# EasyEDA Pro project EDA-Robot_V1.2.epro

# Schematic EDA-Robot插件版
Board Name: Board2; Create Date: 2024-12-02; Page Name: P1; Project Name: EDA-Robot; Schematic Name: EDA-Robot插件版; Update Date: 2024-12-19; Company: 嘉立创EDA; Page Size: A4; Version: V1.0
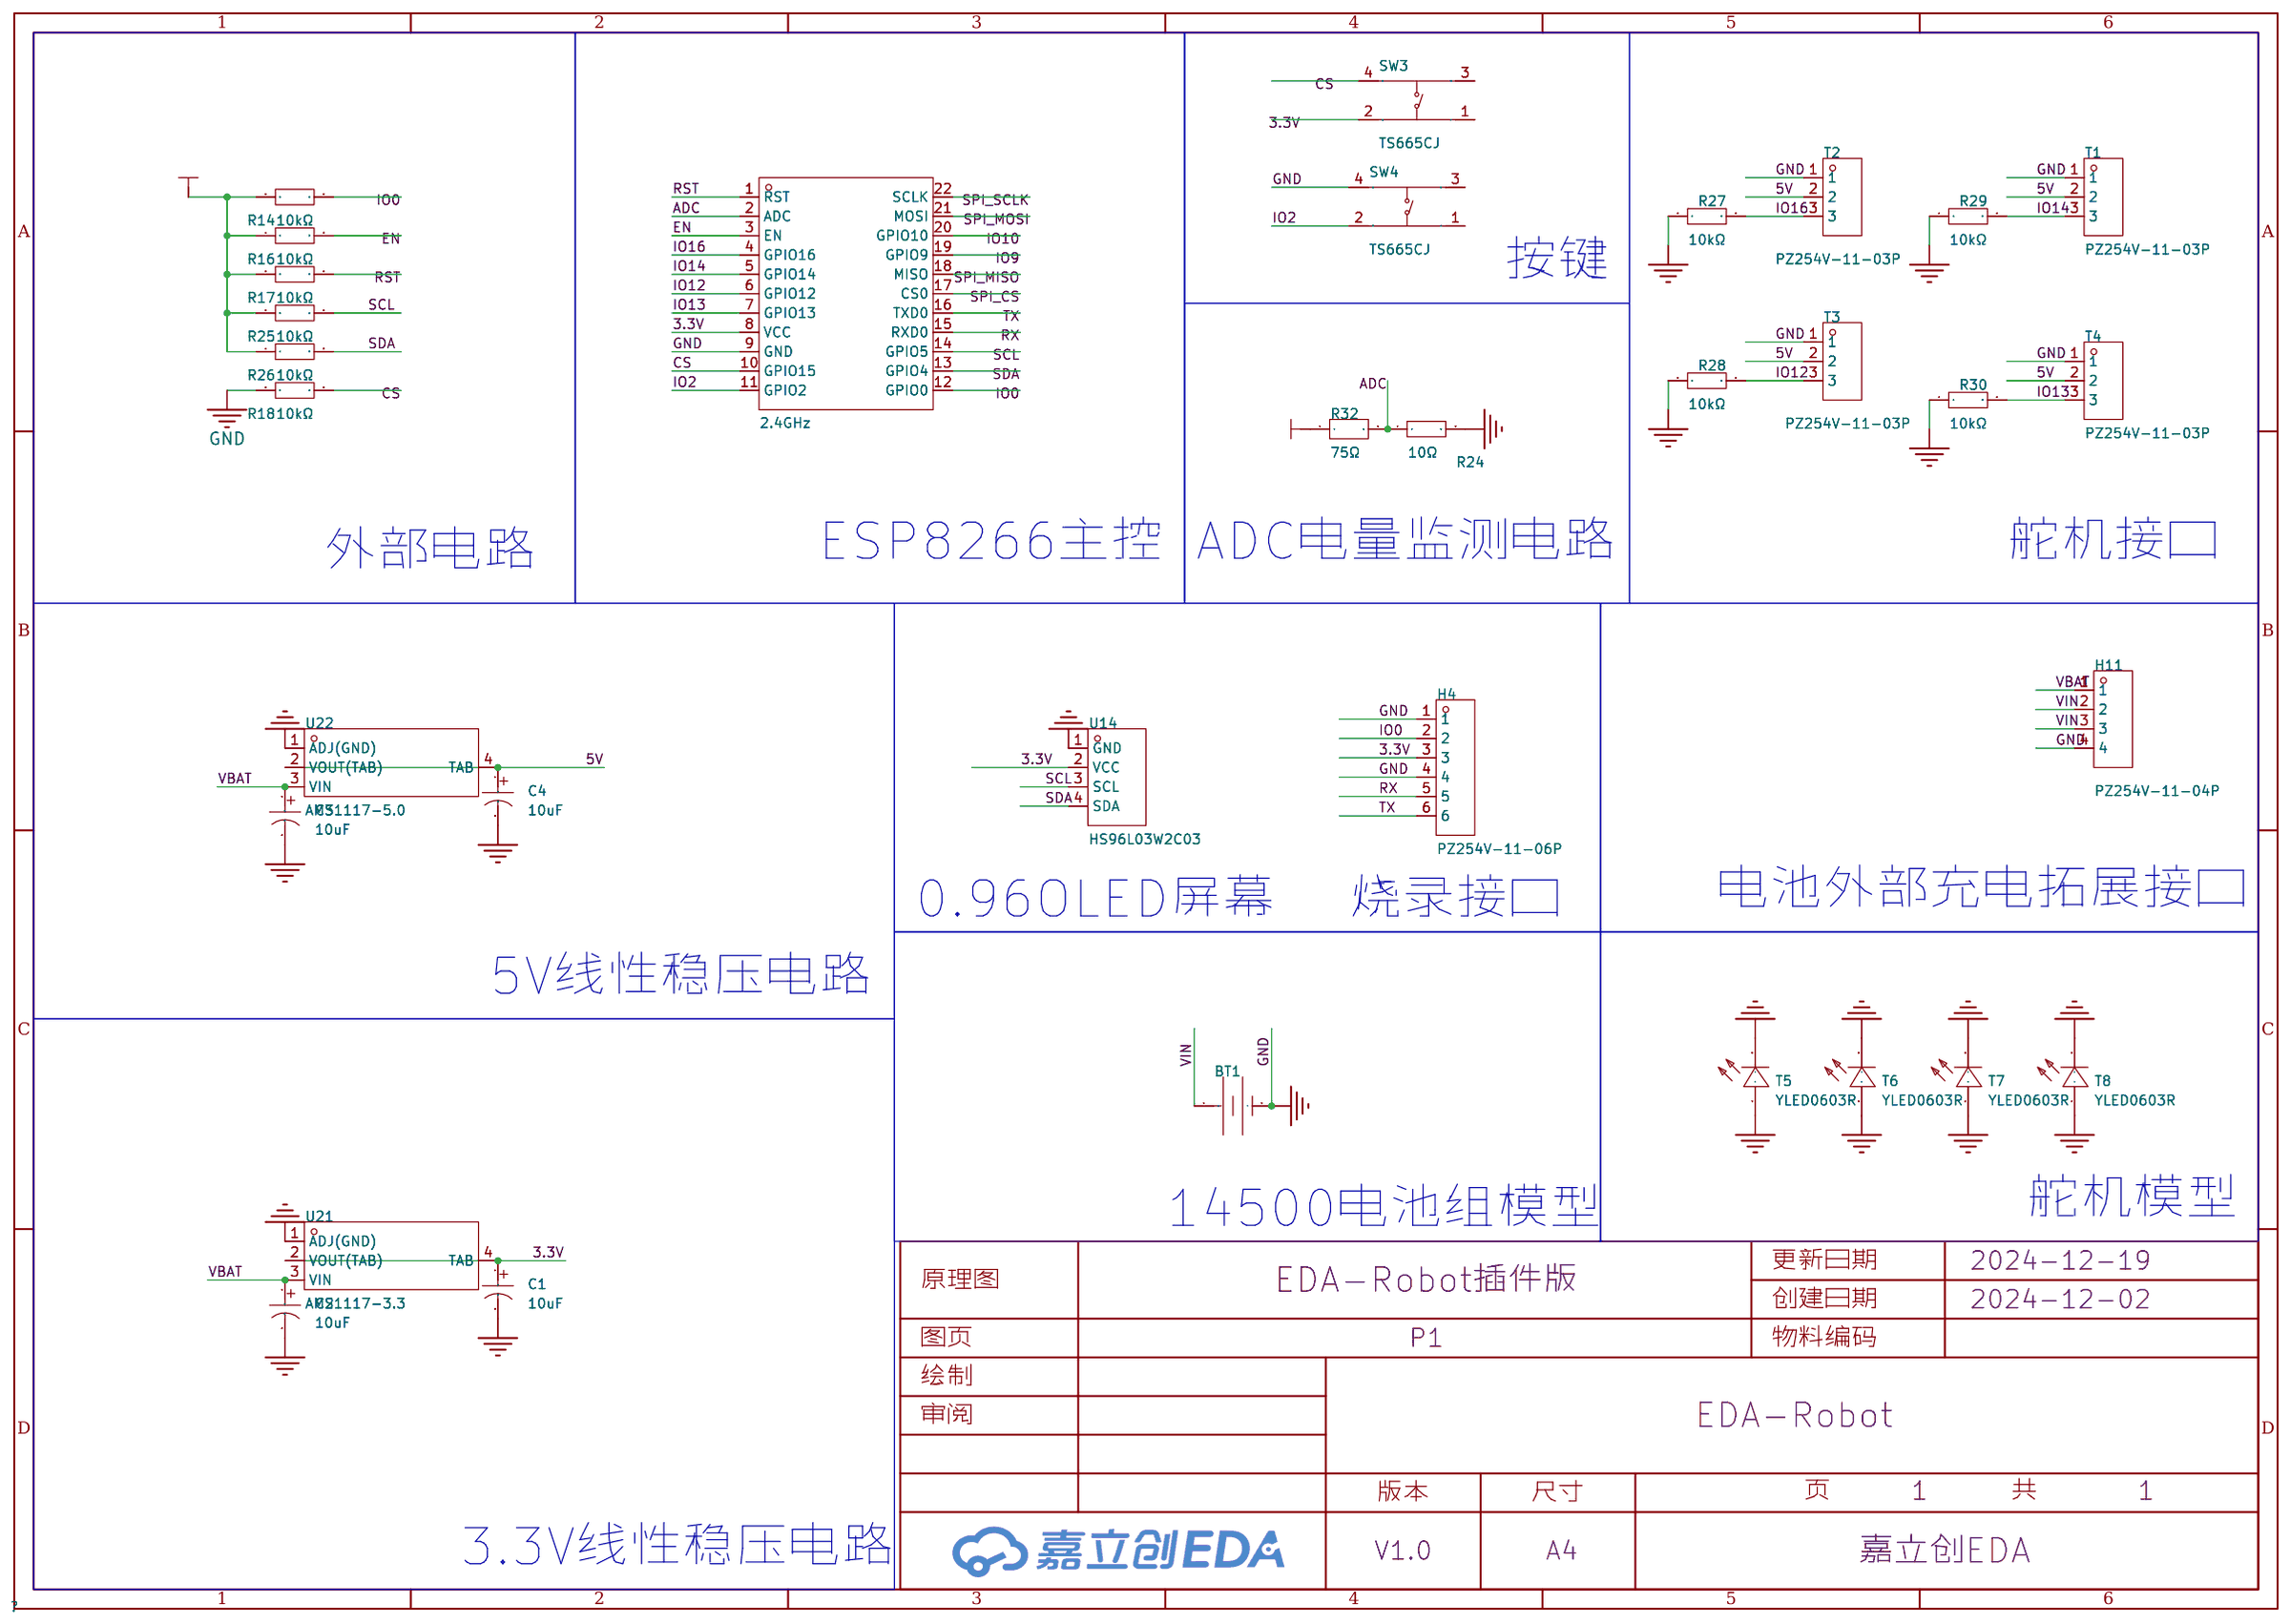
[diagram p0: schematic sheet]

## Parts
BT1  BS-12-B3AA003  [14500电池盒*2]
C1  10uF  [CAP-TH_BD4.0-P1.50-D0.8-FD]
C2  10uF  [CAP-TH_BD4.0-P1.50-D0.8-FD]
C3  10uF  [CAP-TH_BD4.0-P1.50-D0.8-FD]
C4  10uF  [CAP-TH_BD4.0-P1.50-D0.8-FD]
H4  PZ254V-11-06P  [HDR-TH_6P-P2.54-V-M]
H11  PZ254V-11-04P  [HDR-TH_4P-P2.54-V-M]
R14  10kΩ  [RES-TH_BD2.4-L6.3-P10.30-D0.6]
R16  10kΩ  [RES-TH_BD2.4-L6.3-P10.30-D0.6]
R17  10kΩ  [RES-TH_BD2.4-L6.3-P10.30-D0.6]
R18  10kΩ  [RES-TH_BD2.4-L6.3-P10.30-D0.6]
R24  10Ω  [RES-TH_BD2.2-L6.5-P10.50-D0.6]
R25  10kΩ  [RES-TH_BD2.4-L6.3-P10.30-D0.6]
R26  10kΩ  [RES-TH_BD2.4-L6.3-P10.30-D0.6]
R27  10kΩ  [RES-TH_BD2.4-L6.3-P10.30-D0.6]
R28  10kΩ  [RES-TH_BD2.4-L6.3-P10.30-D0.6]
R29  10kΩ  [RES-TH_BD2.4-L6.3-P10.30-D0.6]
R30  10kΩ  [RES-TH_BD2.4-L6.3-P10.30-D0.6]
R32  75Ω  [RES-TH_BD2.4-L6.3-P10.30-D0.6]
SW3  TS665CJ  [SW-TH_4P-L6.0-W6.0-P4.50-LS6.5]
SW4  TS665CJ  [SW-TH_4P-L6.0-W6.0-P4.50-LS6.5]
T1  PZ254V-11-03P  [HDR-TH_3P-P2.54-V-M]
T2  PZ254V-11-03P  [HDR-TH_3P-P2.54-V-M]
T3  PZ254V-11-03P  [HDR-TH_3P-P2.54-V-M]
T4  PZ254V-11-03P  [HDR-TH_3P-P2.54-V-M]
T5  YLED0603R  [LED0603-FD]  (no BOM)
T6  YLED0603R  [LED0603-FD]  (no BOM)
T7  YLED0603R  [LED0603-FD]  (no BOM)
T8  YLED0603R  [LED0603-FD]  (no BOM)
U10  2.4GHz  [WIFIM-SMD_ESP-12F-ESP8266MOD]
U14  HS96L03W2C03  [OLED-TH_L27.8-W27.2-P2.54_C9900033791]
U21  AMS1117-3.3  [SOT-223-4_L6.5-W3.5-P2.30-LS7.0-BR]
U22  AMS1117-5.0  [SOT-223_L6.7-W3.5-P2.30-BR]

## Library data of the parts
BT1 = BS-12-B3AA003: 连接器类型:电池底座;适用电池规格:CR1220;触头材质:磷青铜;工作温度范围:-25℃~+85℃;; LCSC Part Name: 电池底座 适用电池:CR1220; Supplier Part: C964723; Manufacturer: MYOUNG(美阳); Supplier Footprint: SMD; JLCPCB Part Class: 扩展库; Datasheet: https://atta.szlcsc.com/upload/public/pdf/source/20201218/C964723_733B638E287393F86295A2A4DAE43C75.pdf; Supplier: LCSC; Connector Type: 电池底座; Battery Type: CR1220; Contact Material: 磷青铜; Operating Temperature Range: -25℃~+85℃
C1-C4 = KS106M025C07RR0VH2FP0: 容值:10uF;精度:±20%;额定电压:25V;纹波电流:29mA@120Hz;等效串联电阻:-;; LCSC Part Name: 10uF ±20% 25V; Supplier Part: C43351; Manufacturer: CX(承兴); Supplier Footprint: 插件,D4xL7mm; JLCPCB Part Class: 扩展库; Datasheet: https://atta.szlcsc.com/upload/public/pdf/source/20211027/7B10195EF01EB9374BE8935690E3D906.pdf; Supplier: LCSC; Tolerance: ±20%; Rated Voltage: 25V; Ripple Current: 29mA@120Hz; Lead Spacing: 1.5mm; φD: 4mm; L: 7mm; Lifetime @ Temp: 1000hrs@105℃; Operating Temperature: -40℃~+105℃
H4 = PZ254V-11-06P: 插针结构:1x6P;间距:2.54mm;行距:-;圆针/方针:方针;安装类型:直插;排数:单排;总PIN位数:6P;额定电流:-;额定电压:-;配合针长度:6mm;塑高:2.5mm;端接针长度:3mm;触头材质:黄铜;触头镀层:-;工作温度范围:-40℃~+105℃;颜色:黑色;; LCSC Part Name: 间距:2.54mm 1x6P 直插 方针; Supplier Part: C492405; Manufacturer: XFCN(兴飞); Supplier Footprint: 插件,P=2.54mm; JLCPCB Part Class: 扩展库; Datasheet: https://atta.szlcsc.com/upload/public/pdf/source/20200309/C492405_597F1930F5B55CC3C7FD95458F1C3977.pdf; Supplier: LCSC; Pin Structure: 1x6P; Pitch: 2.54mm; Circluar Pins/Square Pins: 方针; Mounting Type: 直插; Number of Rows: 单排; Number of Pins: 6P; Length of Mating Pin: 6mm; Insulation Height: 2.5mm; Length of End Connection Pin: 3mm; Contact Material: 黄铜; Operating Temperature Range: -40℃~+105℃; Color: 黑色
H11 = PZ254V-11-04P: 插针结构:1x4P;间距:2.54mm;行距:-;圆针/方针:方针;安装类型:直插;排数:单排;总PIN位数:4P;额定电流:3A;额定电压:250V;配合针长度:6mm;塑高:2.5mm;端接针长度:3mm;触头材质:-;工作温度范围:-40℃~+105℃;颜色:黑色;; LCSC Part Name: 间距:2.54mm 1x4P 直插 方针; Supplier Part: C2691448; Manufacturer: XFCN(兴飞); Supplier Footprint: 插件,P=2.54mm; JLCPCB Part Class: 扩展库; Datasheet: https://atta.szlcsc.com/upload/public/pdf/source/20200309/C492403_F9F19131791D08044AD4F84F8E751A34.pdf; Supplier: LCSC; Pin Structure: 1x4P; Pitch: 2.54mm; Circluar Pins/Square Pins: 方针; Mounting Type: 直插; Number of Rows: 单排; Number of Pins: 4P; Current Rating (Max): 3A; Voltage Rating (Max): 250V; Length of Mating Pin: 6mm; Insulation Height: 2.5mm; Length of End Connection Pin: 3mm; Operating Temperature Range: -40℃~+105℃; Color: 黑色
R14 R16-R18 R25-R30 = RN1/4W10KFT/BA1: 电阻类型:金属膜电阻;阻值:10kΩ;精度:±1%;功率:250mW;温度系数:±50ppm/℃;; LCSC Part Name: 10kΩ ±1% 250mW 金属膜电阻; Supplier Part: C410695; Manufacturer: Tyohm(幸亚电阻); Supplier Footprint: 插件,D2.4xL6.5mm; JLCPCB Part Class: Extended Part; Datasheet: https://atta.szlcsc.com/upload/public/pdf/source/20190808/C410699_D126E64D28B638F1D73B58E9F61DFD9B.pdf; Supplier: LCSC; Type: 金属膜电阻; Tolerance: ±1%; Overload Voltage (Max): 250V; Power(Watts): 250mW; Temperature Coefficient: ±50ppm/℃; Operating Temperature Range: -55℃~+125℃
R24 = MFR-25FTE52-10R: 电阻类型:金属膜电阻;阻值:10Ω;精度:±1%;功率:250mW;温度系数:±50ppm/℃;; LCSC Part Name: 金属膜电阻 10Ω ±1% 250mW; Supplier Part: C138214; Manufacturer: YAGEO(国巨); Supplier Footprint: 插件,D2.4xL6.3mm; JLCPCB Part Class: Extended Part; Datasheet: https://atta.szlcsc.com/upload/public/pdf/source/20191118/C457825_18355E864DE4965678DC27B0EBC3E21E.pdf; Supplier: LCSC; Type: 金属膜电阻; Tolerance: ±1%; Power(Watts): 250mW; Temperature Coefficient: ±50ppm/℃; Operating Temperature Range: -55℃~+155℃
R32 = MFR-25FTE52-75R: 电阻类型:金属膜电阻;阻值:75Ω;精度:±1%;功率:250mW;温度系数:±50ppm/℃;; LCSC Part Name: 金属膜电阻 75Ω ±1% 250mW; Supplier Part: C513654; Manufacturer: YAGEO(国巨); Supplier Footprint: 插件,D2.4xL6.3mm; JLCPCB Part Class: 扩展库; Datasheet: https://atta.szlcsc.com/upload/public/pdf/source/20191118/C457825_18355E864DE4965678DC27B0EBC3E21E.pdf; Supplier: LCSC; Type: 金属膜电阻; Tolerance: ±1%; Power(Watts): 250mW; Temperature Coefficient: ±50ppm/℃; Operating Temperature Range: -55℃~+155℃
SW3 SW4 = TS665CJ: 电路结构:单刀单掷;按钮形状:圆形按钮;安装方式:直插;开关长度:6mm;开关宽度:6mm;开关高度:5mm;触点电流:50mA;额定电压(DC):12V;带灯:-;机械寿命:-;; LCSC Part Name: 6*6*5mm 直插 轻触开关; Supplier Part: C393938; Manufacturer: SHOU HAN(首韩); Supplier Footprint: 插件; JLCPCB Part Class: 扩展库; Datasheet: https://atta.szlcsc.com/upload/public/pdf/source/20190521/C393938_BDABEAC600B4C55E200A80AA129B70BC.pdf; Supplier: LCSC; Circuit: 单刀单掷; Actuator Style: 圆形按钮; Mounting Style: 直插; Switch Length: 6mm; Switch Width: 6mm; Switch Height: 5mm; Contact Current: 50mA; Voltage Rating (DC): 12V
T1-T4 = PZ254V-11-03P: 插针结构:1x3P;间距:2.54mm;行距:-;圆针/方针:方针;安装类型:直插;排数:单排;总PIN位数:3P;额定电流:3A;额定电压:250V;配合针长度:6mm;塑高:2.5mm;端接针长度:3mm;工作温度范围:-40℃~+105℃;颜色:黑色;; LCSC Part Name: 间距:2.54mm 1x3P 直插 方针; Supplier Part: C2937625; Manufacturer: XFCN(兴飞); Supplier Footprint: 插件,P=2.54mm; JLCPCB Part Class: 扩展库; Datasheet: https://atta.szlcsc.com/upload/public/pdf/source/20200309/C492402_8335C3D49C4E4C618838D59BB1D024C1.pdf; Supplier: LCSC; Pin Structure: 1x3P; Pitch: 2.54mm; Circluar Pins/Square Pins: 方针; Mounting Type: 直插; Number of Rows: 单排; Number of Pins: 3P; Current Rating (Max): 3A; Voltage Rating (Max): 250V; Length of Mating Pin: 6mm; Insulation Height: 2.5mm; Length of End Connection Pin: 3mm; Operating Temperature Range: -40℃~+105℃; Color: 黑色
T5-T8 = YLED0603R: 发光颜色:红色;正向电压(VF):1.8V~2.4V;功率:-;正向电流:25mA;主波长:620nm~625nm;二极管配置:-;透镜颜色:-;色温:-;发光强度:-;发光角度:-;载带方式:-;工作温度:-40℃~+85℃;; Supplier Part: C19171390; Manufacturer: YONGYUTAI(永裕泰); Supplier Footprint: 0603; JLCPCB Part Class: 扩展库; Datasheet: https://atta.szlcsc.com/upload/public/pdf/source/20231027/FB19AF06E2C70028E58AB5CEDD1BDC72.pdf; Supplier: LCSC; Emitted Color: 红色; Forward Voltage (VF): 1.8V~2.4V; Forward Current: 25mA; Dominant Wavelength: 620nm~625nm; Operating Temperature: -40℃~+85℃
U10 = ESP-12F(ESP8266MOD): 频率:2.4GHz;发射功率:16dBm;核心处理器:ESP8266;天线形式:PCB 板载天线;接收灵敏度:-90dBm;; LCSC Part Name: 完整的802.11b/g/n Wi-Fi的SoC模块; Supplier Part: C82891; Manufacturer: Ai-Thinker(安信可); Supplier Footprint: SMD,16x24mm; JLCPCB Part Class: Extended Part; Datasheet: https://atta.szlcsc.com/upload/public/pdf/source/20210219/C82891_ABD84A460F4F056A2757267CCCA4B508.pdf; Supplier: LCSC; Output Power: 16dBm; Core Processor: ESP8266; Support Interface: GPIO；UART；I2C；PWM；SPI；ADC; Antenna Type: PCB 板载天线; Wireless Standard: 802.11b/g/n; Operating Voltage: 3.3V; Receive  Current: 120mA; Send  Current: 170mA; Sensitivity: -90dBm; Operating Temperature: -40℃~+85℃
U14 = HS96L03W2C03: 主控芯片:SSD1315;接口类型:I2C;尺寸(inch):0.96;像素分辨率:128x64;; LCSC Part Name: 0.96寸OLED显示屏窄白光IIC; Supplier Part: C5248080; Manufacturer: HS(汉昇); JLCPCB Part Class: 扩展库; Datasheet: https://atta.szlcsc.com/upload/public/pdf/source/20230627/763D01F79A90007632F098068C7C8AD9.pdf; Supplier: LCSC; Main Control Chip: SSD1315; Interface Type: I2C; Size: 0.96; Pixel Resolution: 128x64; Operating Temperature: -40℃~+70℃
U21 = AMS1117-3.3_C347222: 输出类型:固定;最大输入电压:18V;输出电压:3.3V;输出电流:1A;电源纹波抑制比(PSRR):60dB@(120Hz);输出极性:正极;; LCSC Part Name: 输出:3.3V 电流:1A 耐压:12V; Supplier Part: C347222; Manufacturer: UMW(友台半导体); Supplier Footprint: SOT-223; JLCPCB Part Class: 扩展库; Datasheet: https://atta.szlcsc.com/upload/public/pdf/source/20231109/155D79A26D9DB04352555A58D5969DC8.pdf; Supplier: LCSC; Output Type: 固定; Maximum Input Voltage: 18V; Output Voltage: 3.3V; Output Current: 1A; Power Supply Rejection Ratio (PSRR): 60dB@(120Hz); Dropout Voltage: 1.3V@(1A); Feature: 过流保护(OCP); Output Polarity: 正极; Number of Outputs: 1
U22 = AMS1117-5.0_C347223: 输出类型:固定;最大输入电压:12V;输出电压:5V;最大输出电流:1A;电源纹波抑制比(PSRR):60dB@(120Hz);输出极性:正极;; LCSC Part Name: 输出:5V 电流:1A 耐压:12V; Supplier Part: C347223; Manufacturer: UMW(友台半导体); Supplier Footprint: SOT-223; JLCPCB Part Class: 扩展库; Datasheet: https://atta.szlcsc.com/upload/public/pdf/source/20231109/155D79A26D9DB04352555A58D5969DC8.pdf; Supplier: LCSC; Output Type: 固定; Maximum Input Voltage: 12V; Output Voltage: 5V; MAX Output Current: 1A; Power Supply Rejection Ratio (PSRR): 60dB@(120Hz); Dropout Voltage: 1.3V@(1A); Output Polarity: 正极; Number of Outputs: 1

## Nets
3.3V: C1.1 H4.3 R14.1 R16.1 R17.1 R25.1 R26.1 SW3.2(B) U10.8(VCC) U14.2(VCC) U21.2(VOUT(TAB)) U21.4(TAB)
5V: C4.1 T1.2 T2.2 T3.2 T4.2 U22.2(VOUT(TAB)) U22.4(TAB)
GND: BT1.2(-) C1.2 C2.2 C3.2 C4.2 H4.1 H4.4 H11.4 R18.1 R24.2 R27.1 R28.1 R29.1 R30.1 SW4.4(D) T1.1 T2.1 T3.1 T4.1 T5.1(+) T5.2(-) T6.1(+) T6.2(-) T7.1(+) T7.2(-) T8.1(+) T8.2(-) U10.9(GND) U14.1(GND) U21.1(ADJ(GND)) U22.1(ADJ(GND))
VBAT: C2.1 C3.1 H11.1 R32.1 U21.3(VIN) U22.3(VIN)
VIN: BT1.1(+) H11.2 H11.3
ADC: R24.1 R32.2 U10.2(ADC)
CS: R18.2 SW3.4(D) U10.10(GPIO15)
EN: R16.2 U10.3(EN)
IO0: H4.2 R14.2 U10.12(GPIO0)
IO2: SW4.2(B) U10.11(GPIO2)
IO9: U10.19(GPIO9)
IO10: U10.20(GPIO10)
IO12: R28.2 T3.3 U10.6(GPIO12)
IO13: R30.2 T4.3 U10.7(GPIO13)
IO14: R29.2 T1.3 U10.5(GPIO14)
IO16: R27.2 T2.3 U10.4(GPIO16)
RST: R17.2 U10.1(RST)
RX: H4.5 U10.15(RXD0)
SCL: R25.2 U10.14(GPIO5) U14.3(SCL)
SDA: R26.2 U10.13(GPIO4) U14.4(SDA)
SPI_CS: U10.17(CS0)
SPI_MISO: U10.18(MISO)
SPI_MOSI: U10.21(MOSI)
SPI_SCLK: U10.22(SCLK)
TX: H4.6 U10.16(TXD0)

Not connected (* = marked no-connect by the designer): SW3 1(A) 3(C); SW4 1(A) 3(C)

## Notes on the sheet
- 按键
- ESP8266主控
- ADC电量监测电路
- 舵机接口
- 外部电路
- 电池外部充电拓展接口
- 0.96OLED屏幕
- 烧录接口
- 5V线性稳压电路
- 14500电池组模型
- 舵机模型
- 3.3V线性稳压电路

# Board PCB2
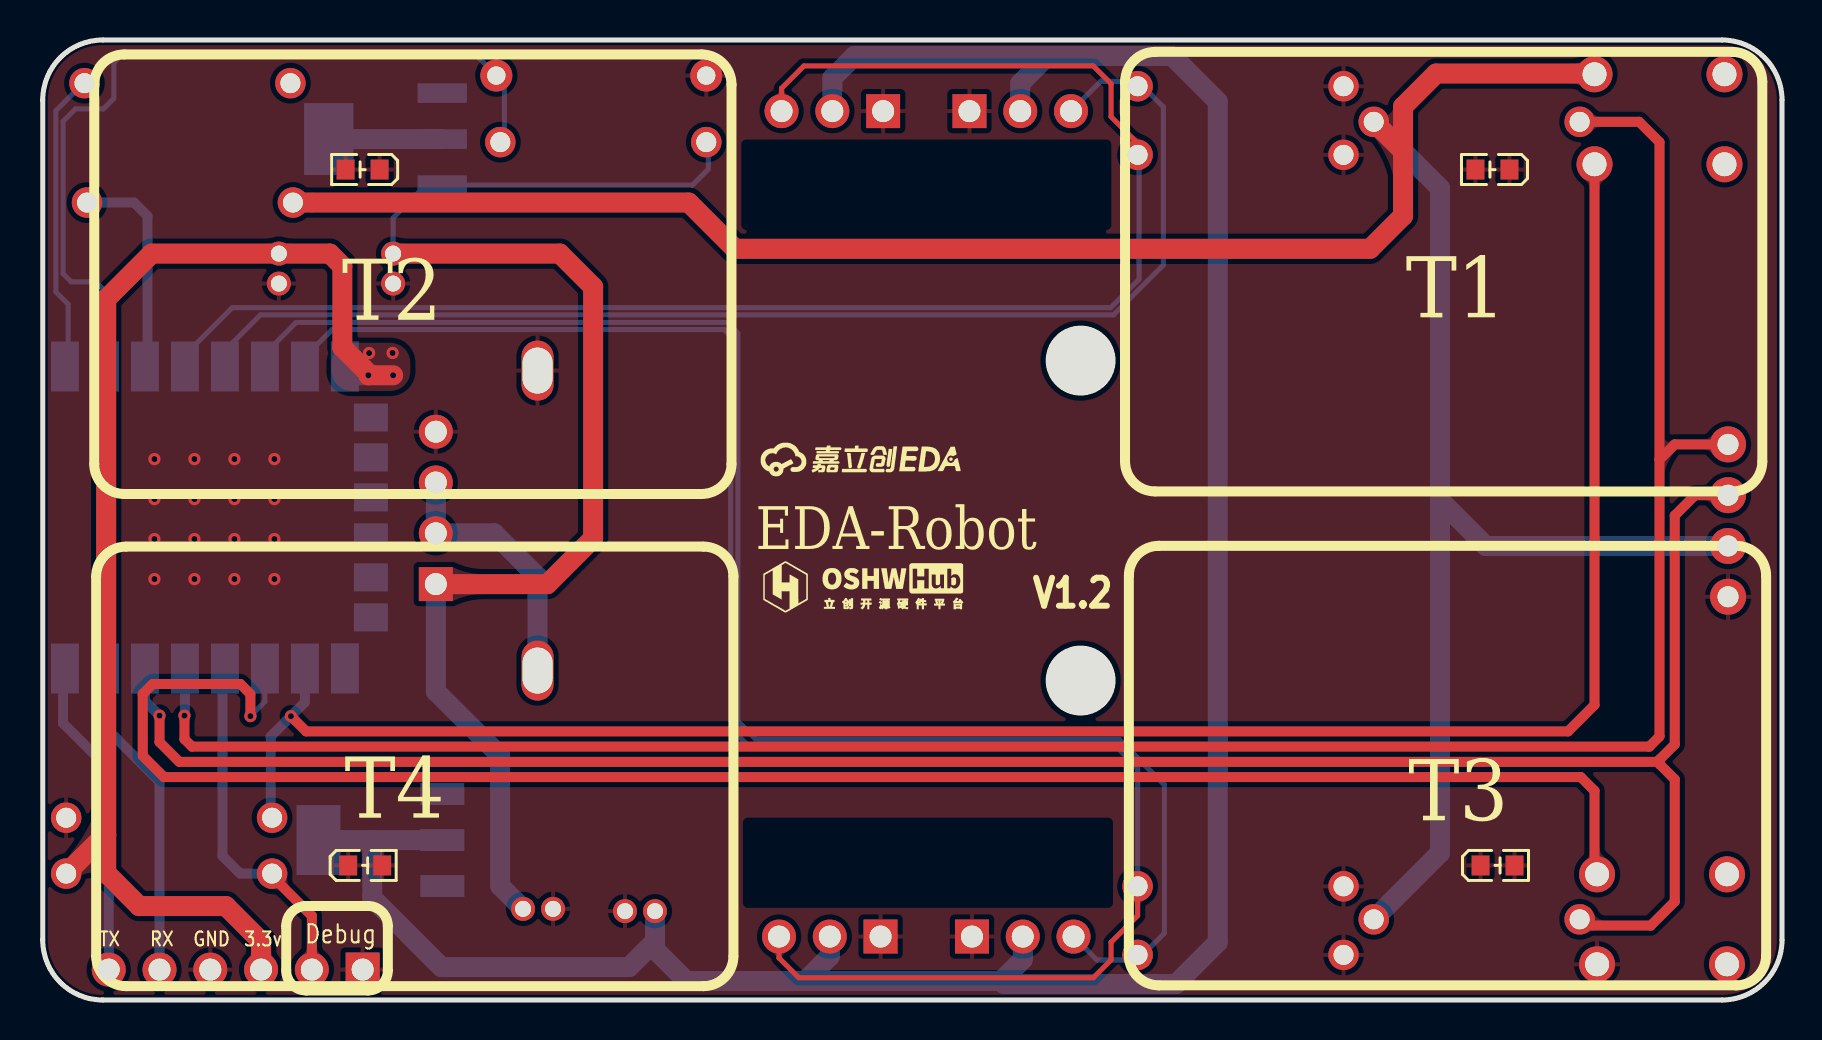
[diagram p1: board, top side]
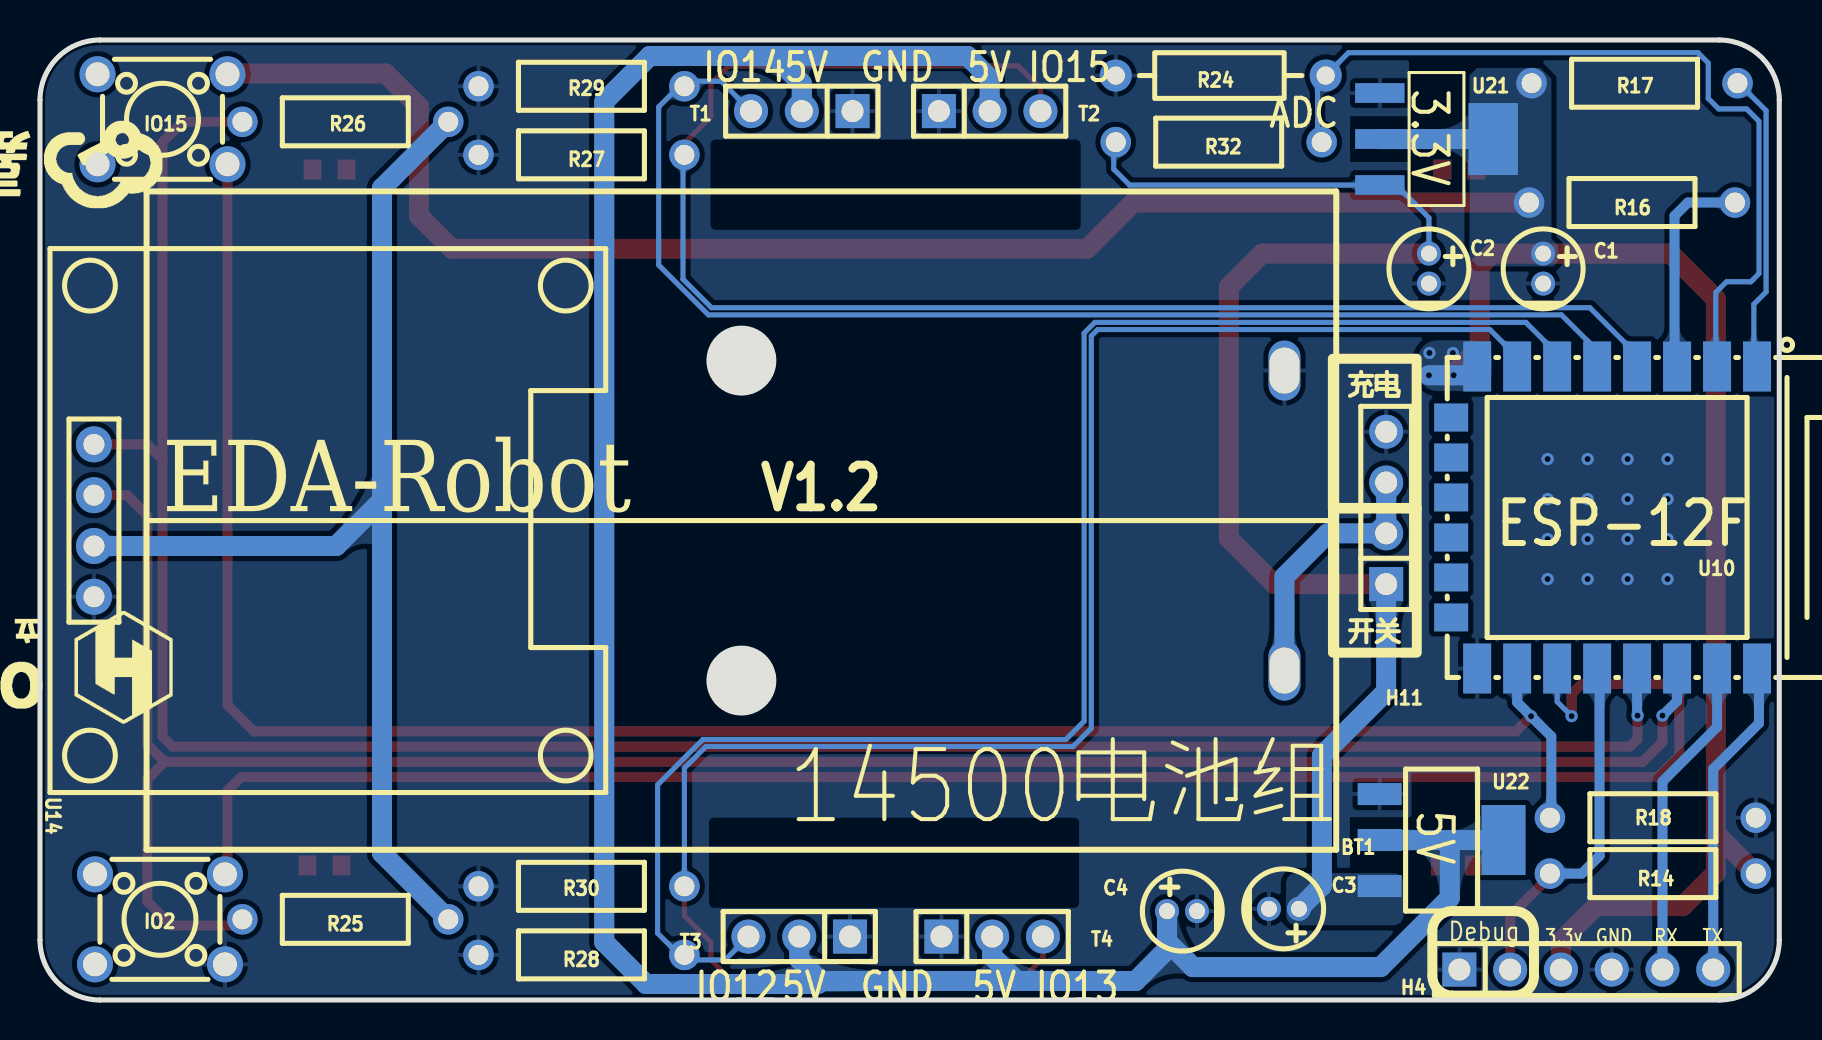
[diagram p2: board, bottom side, seen from below]

Outline 87 x 48 mm; copper layers: Top Layer, Bottom Layer. Coordinates in mm from the lower left corner of the outline.
Outline path: 0,45 arc(0.88,47.12) 3,48 84,48 arc(86.12,47.12) 87,45 87,3 arc(86.12,0.88) 84,0 3,0 arc(0.88,0.88) 0,3 0,45
Stack: Top Layer 0.035mm / Dielectric1 1.51mm FR4 er 4.5 / Bottom Layer 0.035mm

## Design rules (mm)
template: JLCPCB Capability(Two Layers Board)
spacing copperThickness1oz (default): track to track 0.102, other pairs 0.152 to 0.3
spacing copperThickness2oz: track to track 0.203, other pairs 0.152 to 0.3
track width copperThickness1oz (default): min 0.127, default 0.254, max 2.54
track width copperThickness2oz: min 0.203, default 0.254, max 2.54
differential pair differentialPair (default): width min 0.127, default 0.254, max 2.54; gap min 0.152, default 0.152
via viaSize (default): diameter min 0.5, default 0.61, max 10; hole min 0.3, default 0.305, max 6.3

## Placement (name value [footprint] x y rotation side)
BT1  BS-12-B3AA003  [14500电池盒*2]  51.92 23.97 0 bottom
C1  10uF  [CAP-TH_BD4.0-P1.50-D0.8-FD]  11.81 36.57 270 bottom
C2  10uF  [CAP-TH_BD4.0-P1.50-D0.8-FD]  17.53 36.57 270 bottom
C3  10uF  [CAP-TH_BD4.0-P1.50-D0.8-FD]  24.78 4.56 0 bottom
C4  10uF  [CAP-TH_BD4.0-P1.50-D0.8-FD]  29.88 4.44 180 bottom
H4  PZ254V-11-06P  [HDR-TH_6P-P2.54-V-M]  9.65 1.52 180 bottom
H11  PZ254V-11-04P  [HDR-TH_4P-P2.54-V-M]  19.66 24.61 90 bottom
IO2  TS665CJ  [SW-TH_4P-L6.0-W6.0-P4.50-LS6.5]  81 4.03 180 bottom
IO15  TS665CJ  [SW-TH_4P-L6.0-W6.0-P4.50-LS6.5]  80.87 44.04 180 bottom
R14  10kΩ  [RES-TH_BD2.4-L6.3-P10.30-D0.6]  6.32 6.32 0 bottom
R16  10kΩ  [RES-TH_BD2.4-L6.3-P10.30-D0.6]  7.37 39.88 180 bottom
R17  10kΩ  [RES-TH_BD2.4-L6.3-P10.30-D0.6]  7.24 45.84 180 bottom
R18  10kΩ  [RES-TH_BD2.4-L6.3-P10.30-D0.6]  6.32 9.11 0 bottom
R24  10Ω  [RES-TH_BD2.2-L6.5-P10.50-D0.6]  27.94 46.22 0 bottom
R25  10kΩ  [RES-TH_BD2.4-L6.3-P10.30-D0.6]  71.73 4.03 0 bottom
R26  10kΩ  [RES-TH_BD2.4-L6.3-P10.30-D0.6]  71.73 43.91 0 bottom
R27  10kΩ  [RES-TH_BD2.4-L6.3-P10.30-D0.6]  59.92 42.26 180 bottom
R28  10kΩ  [RES-TH_BD2.4-L6.3-P10.30-D0.6]  59.92 2.26 180 bottom
R29  10kΩ  [RES-TH_BD2.4-L6.3-P10.30-D0.6]  59.92 45.69 180 bottom
R30  10kΩ  [RES-TH_BD2.4-L6.3-P10.30-D0.6]  59.92 5.69 180 bottom
R32  75Ω  [RES-TH_BD2.4-L6.3-P10.30-D0.6]  28.04 42.9 180 bottom
T1  PZ254V-11-03P  [LED0603-FD]  72.52 41.53 0 top
T1#2  -  [HDR-TH_3P-P2.54-V-M]  48.89 44.45 0 bottom
T2  PZ254V-11-03P  [LED0603-FD]  16 41.53 0 top
T2#2  -  [HDR-TH_3P-P2.54-V-M]  39.5 44.45 180 bottom
T3  PZ254V-11-03P  [LED0603-FD]  72.77 6.73 180 top
T3#2  -  [HDR-TH_3P-P2.54-V-M]  49.02 3.17 0 bottom
T4  PZ254V-11-03P  [LED0603-FD]  16.13 6.73 180 top
T4#2  -  [HDR-TH_3P-P2.54-V-M]  39.37 3.17 180 bottom
U10  2.4GHz  [WIFIM-SMD_ESP-12F-ESP8266MOD]  8.76 24.13 0 bottom
U14  HS96L03W2C03  [OLED-TH_L27.8-W27.2-P2.54_C9900033791]  84.3 23.97 90 bottom
U21  AMS1117-3.3  [SOT-223-4_L6.5-W3.5-P2.30-LS7.0-BR]  17.14 43.05 0 bottom
U22  AMS1117-5.0  [SOT-223_L6.7-W3.5-P2.30-BR]  16.89 8 0 bottom

## Footprints (pads in the part's own frame, mm; a bottom-side part is the same pattern mirrored in y, then rotated)
14500电池盒*2
  oval 1.6x3 hole 1.5x2.3: 1(-27.165,7.5) 2(-27.165,-7.5)
CAP-TH_BD4.0-P1.50-D0.8-FD
  round 1.2 hole 0.8: 1(-0.75,0) 2(0.75,0)
HDR-TH_3P-P2.54-V-M
  rect 1.7x1.7 hole 1.1: 1(-2.54,0)
  round 1.7 hole 1.1: 2(0,0) 3(2.54,0)
HDR-TH_4P-P2.54-V-M
  rect 1.7x1.7 hole 1.1: 1(-3.81,0)
  round 1.7 hole 1.1: 2(-1.27,0) 3(1.27,0) 4(3.81,0)
HDR-TH_6P-P2.54-V-M
  rect 1.7x1.7 hole 1.1: 1(-6.35,0)
  round 1.7 hole 1.1: 2(-3.81,0) 3(-1.27,0) 4(1.27,0) 5(3.81,0) 6(6.35,0)
LED0603-FD
  rect 0.9x1 smd: 1(-0.85,0) 2(0.85,0)
OLED-TH_L27.8-W27.2-P2.54_C9900033791
  round 1.8 hole 1.05: 1(-3.81,0) 2(-1.27,0) 3(1.27,0) 4(3.81,0)
RES-TH_BD2.2-L6.5-P10.50-D0.6
  round 1.6 hole 0.914: 1(-5.25,0) 2(5.25,0)
RES-TH_BD2.4-L6.3-P10.30-D0.6
  round 1.524 hole 1: 1(-5.15,0) 2(5.15,0)
SOT-223-4_L6.5-W3.5-P2.30-LS7.0-BR
  rect 2.47x0.98 smd: 1(2.835,-2.3) 2(2.835,0) 3(2.835,2.3)
  rect 2.47x3.6 smd: 4(-2.835,0)
SOT-223_L6.7-W3.5-P2.30-BR
  rect 2.2x1.1 smd: 1(3.099,-2.3) 2(3.099,0) 3(3.099,2.3)
  rect 2.2x3.5 smd: 4(-3.099,0)
SW-TH_4P-L6.0-W6.0-P4.50-LS6.5
  round 1.8 hole 1.2: 1(-3.25,2.25) 2(3.25,2.25) 3(-3.25,-2.25) 4(3.25,-2.25)
WIFIM-SMD_ESP-12F-ESP8266MOD
  rect 1.4x2.5 smd: 1(-7.651,-7.551) 2(-5.651,-7.551) 3(-3.651,-7.551) 4(-1.651,-7.551) 5(0.349,-7.551) 6(2.349,-7.551) 7(4.349,-7.551) 8(6.349,-7.551) 9(6.349,7.548) 10(4.349,7.55) 11(2.349,7.551) 12(0.349,7.551) 13(-1.651,7.55) 14(-3.651,7.551) 15(-5.651,7.551) 16(-7.651,7.551)
  rect 1.7x1.4 smd: 17(7.651,-5) 18(7.649,-3.002) 19(7.649,-1.004) 20(7.649,0.998) 21(7.649,2.997) 22(7.651,4.997)

## Nets
3.3V: C1.1 H4.3 IO15.2 R14.1 R16.1 R17.1 R25.1 R26.1 U10.8 U14.2 U21.2 U21.4
5V: C4.1 T1#2.2 T2#2.2 T3#2.2 T4#2.2 U22.2 U22.4
GND: BT1.2 C1.2 C2.2 C3.2 C4.2 H4.1 H4.4 H11.4 IO2.4 R18.1 R24.2 R27.1 R28.1 R29.1 R30.1 T1.1 T1.2 T1#2.1 T2.1 T2.2 T2#2.1 T3.1 T3.2 T3#2.1 T4.1 T4.2 T4#2.1 U10.9 U14.1 U21.1 U22.1
VBAT: C2.1 C3.1 H11.1 R32.1 U21.3 U22.3
VIN: BT1.1 H11.2 H11.3
ADC: R24.1 R32.2 U10.2
CS: IO15.4 R18.2 U10.10
EN: R16.2 U10.3
IO0: H4.2 R14.2 U10.12
IO2: IO2.2 U10.11
IO9: U10.19
IO10: U10.20
IO12: R28.2 T3#2.3 U10.6
IO13: R30.2 T4#2.3 U10.7
IO14: R29.2 T1#2.3 U10.5
IO16: R27.2 T2#2.3 U10.4
RST: R17.2 U10.1
RX: H4.5 U10.15
SCL: R25.2 U10.14 U14.3
SDA: R26.2 U10.13 U14.4
SPI_CS: U10.17
SPI_MISO: U10.18
SPI_MOSI: U10.21
SPI_SCLK: U10.22
TX: H4.6 U10.16

Pads without a net: IO2 1 3; IO15 1 3

## Via types
v1: diameter 0.61, hole 0.305, Top Layer to Bottom Layer, 24 vias

## Routing (per net, layer and track width the routed paths; a pad name or vN(x,y) marks a point on that pad's centre or on a via; arc(x,y) is an arc through that point)
3.3V: length 203.7
  Top Layer w1: 68.05,42.45 R26.1 ; 68.05,42.45 68.05,39.21 66.39,37.56 34.63,37.56 32.31,39.88 R16.1 ; 68.05,42.45 68.05,44.67 69.7,46.33 77.53,46.33 77.62,46.42 ; H4.3 10.92,2.94 9.16,4.7 4.83,4.7 3.17,6.35 3.17,8.24 ; 3.17,8.24 3.09,8.24 R14.1 1.17,6.24 ; 3.17,8.24 3.17,35.05 5.45,37.32 C1.1 14.36,37.32 14.99,36.7 14.99,32.64 16.29,31.33 v1(16.29,31.24) v1(17.53,31.24)
  Bottom Layer w1: 69.89,24.99 72.18,22.7 U14.2 ; 69.89,24.99 69.89,7.35 R25.1 ; 69.89,24.99 69.89,40.6 R26.1 ; U21.4 U21.2 ; v1(17.53,31.24) v1(16.29,31.24) 15.55,31.24 U10.8
  vias: v1(16.33,32.35) v1(17.5,32.36)
5V: length 129.9
  Bottom Layer w1: 30.63,2.94 30.63,2.52 32.19,0.95 38.13,0.95 ; 30.63,2.94 C4.1 ; 30.63,2.94 29.34,1.65 19.94,1.65 16.48,5.11 16.48,8 ; 50.27,47.2 56.5,47.2 58.77,44.93 58.77,2.89 56.68,0.8 48.09,0.8 47.94,0.95 ; 50.27,47.2 40.6,47.2 39.5,46.1 T2#2.2 ; 50.27,47.2 48.89,45.83 T1#2.2 ; 38.13,0.95 47.94,0.95 ; 38.13,0.95 39.37,2.19 T4#2.2 ; U22.4 16.48,8 ; 16.48,8 U22.2 ; 47.94,0.95 49.02,2.03 T3#2.2
GND:
  vias: v1(5.59,27.05) v1(5.59,25.05) v1(5.59,23.05) v1(5.59,21.05) v1(7.59,27.05) v1(7.59,25.05) v1(7.59,23.05) v1(7.59,21.05) v1(9.59,27.05) v1(9.59,25.05) v1(9.59,23.05) v1(9.59,21.05) v1(11.59,27.05) v1(11.59,25.05) v1(11.59,23.05) v1(11.59,21.05)
VBAT: length 70.1
  Top Layer w1: C2.1 25.87,37.32 27.53,35.66 27.53,23.08 25.24,20.8 H11.1
  Bottom Layer w0.254: C2.1 17.53,39.11 19.16,40.75 U21.3 32.5,40.75 33.29,41.55 33.29,42.92
  Bottom Layer w1: H11.1 19.66,15.43 22.88,12.22 22.88,5.71 C3.1
VIN: length 13.2
  Bottom Layer w1: BT1.1 24.75,21.17 22.58,23.34 H11.2 H11.3
ADC: length 42
  Bottom Layer w0.254: U10.2 3.17,31.74 3.17,35.38 2.64,35.91 1.42,35.91 1.02,36.32 1.02,43.94 1.63,44.56 3.03,44.56 3.56,45.08 3.56,46.86 4.06,47.37 21.55,47.37 R24.1 23.09,45.82 23.09,42.92
CS: length 101.2
  Top Layer w0.5: 77.62,41.66 77.62,14.75 76.3,13.43 13.17,13.43 v1(12.42,14.19)
  Bottom Layer w0.5: U10.10 13.11,14.89 v1(12.42,14.19) 11.4,13.18 11.4,9.17 11.35,9.11
EN: length 10.8
  Bottom Layer w0.5: 5.24,31.68 5.24,39.21 4.57,39.88 R16.2
IO0: length 17.8
  Top Layer w0.5: H4.2 13.46,4.2 11.35,6.32
  Bottom Layer w0.5: U10.12 8.99,16.45 8.99,7.21 9.88,6.32 11.35,6.32
IO2: length 90.2
  Top Layer w0.5: 77.62,6.28 77.62,10.46 76.93,11.15 6.07,11.15 5,12.21 5,15.3 5.5,15.8 9.89,15.8 10.39,15.3 v1(10.39,14.19)
  Bottom Layer w0.254: v1(10.39,14.19) 11.11,14.92 U10.11
IO12: length 80.2
  Bottom Layer w0.254: U10.6 11.11,32.32 12.67,33.88 34.24,33.88 34.77,33.35 34.77,13.94 35.68,13.03 53.84,13.03 56.11,10.76 56.11,3.34 54.77,2 52.73,2 T3#2.3
IO13: length 91.9
  Top Layer w0.254: T4#2.3 36.83,2.1 37.82,1.11 52.55,1.11 53.44,2 53.44,2.89 54.77,4.22 54.77,5.56
  Bottom Layer w0.254: 54.77,5.56 54.77,11.6 53.69,12.67 35.33,12.67 34.42,13.58 34.42,33.2 34.09,33.53 14.48,33.53 13.24,32.29 13.24,31.81 U10.7
IO14: length 63.2
  Bottom Layer w0.254: T1#2.3 52.93,45.94 54.77,45.94 56.05,44.66 56.05,36.75 53.56,34.26 10.89,34.26 9.11,32.48 U10.5
IO16: length 78.7
  Top Layer w0.254: 54.77,42.39 54.77,42.84 53.44,44.17 53.44,45.82 52.55,46.71 38.07,46.71 36.96,45.59 T2#2.3
  Bottom Layer w0.254: 54.77,42.39 54.84,42.32 54.84,36.04 53.42,34.62 9.47,34.62 7.24,32.38 7.24,31.81 U10.4
RST: length 15.1
  Bottom Layer w0.254: R17.2 2.03,45.84 0.66,44.47 0.66,35.41 1.27,34.8 1.27,31.71 1.24,31.68
RX: length 16.2
  Bottom Layer w0.5: U10.15 3.11,13.65 5.84,10.92 H4.5
SCL: length 108
  Top Layer w0.5: U14.3 82.65,25.24 81.63,24.23 81.63,12.78 80.89,12.03 ; 80.89,12.03 80.89,11.78 81.63,11.03 81.63,4.92 80.43,3.72 76.93,3.72 76.88,3.78 R25.2 ; 80.89,12.03 80.76,11.91 6.83,11.91 5.84,12.9 v1(5.84,14.22)
  Bottom Layer w0.5: U10.14 5.11,14.95 v1(5.84,14.22)
SDA: length 115.6
  Top Layer w0.5: 80.87,27.02 80.87,42.9 79.86,43.91 R26.2 ; 80.87,27.02 81.63,27.78 U14.4 ; 80.87,27.02 80.87,13.18 80.36,12.67 7.47,12.67 7.09,13.05 v1(7.09,14.22)
  Bottom Layer w0.5: v1(7.09,14.22) 7.11,14.24 U10.13
TX: length 16
  Bottom Layer w0.5: U10.16 1.02,16.48 1.02,13.84 3.3,11.55 H4.6

## Copper pours and planes (outline as drawn; the poured copper is in the pictures)
3.3V on Top Layer: 14.45,32.86 18.39,32.86 18.39,30.45 14.45,30.45
3.3V on Bottom Layer: 11.05,46.61 15.49,46.61 15.49,36.69 11.05,36.69
3.3V on Bottom Layer: 14.38,32.99 18.09,32.99 18.09,30.45 14.38,30.45
GND on Top Layer: -6.1,-8.77 -6.1,69.72 102.23,69.72 102.23,-8.77
GND on Bottom Layer: -4.44,-7.37 -4.44,52.32 90.55,52.32 90.55,-7.37
VBAT on Bottom Layer: 18.8,6.35 24.67,6.35 24.67,3.74 18.8,3.74

Small or netless copper shapes (teardrops, artwork), in the pictures only: 27 on Top Layer, 61 on Bottom Layer

## Text on the board
Bottom Silkscreen Layer: TX | RX | GND | 3.3v | Debug | IO12 | ADC | IO13 | IO15 | 5V | IO14 | 3.3V | ESP-12F | V1.2 | 充电 | 开关 | 14500电池组 | EDA-Robot
Top Silkscreen Layer: TX | RX | GND | 3.3v | Debug | V1.2 | EDA-Robot
